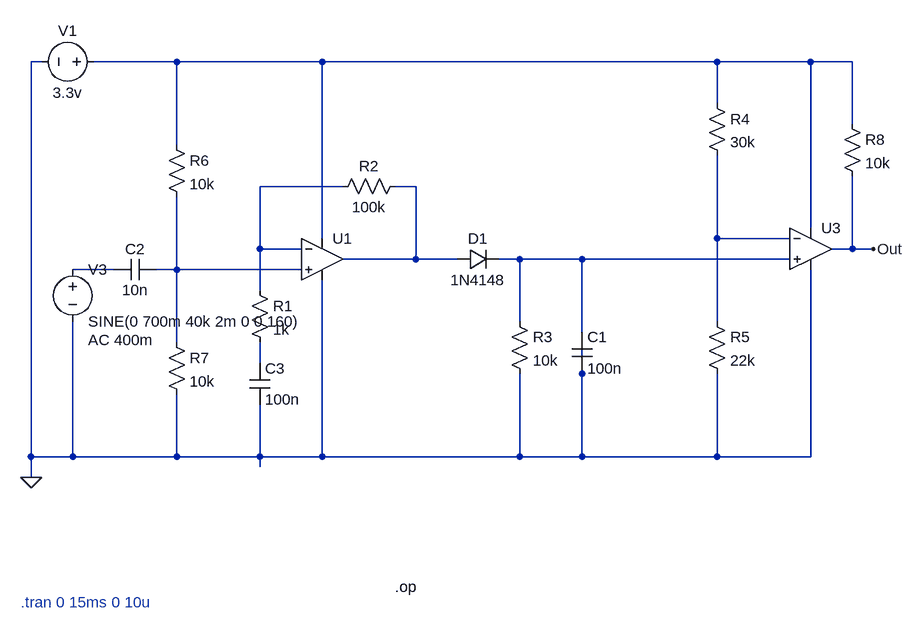
[diagram p0: schematic Ultrasound Sensor Schematic.asc]
Ultrasound Sensor Schematic.asc, the LTspice schematic file:
Version 4.1
SHEET 1 1020 724
WIRE -320 -272 -336 -272
WIRE -112 -272 -240 -272
WIRE 112 -272 -112 -272
WIRE 720 -272 112 -272
WIRE 864 -272 720 -272
WIRE 928 -272 864 -272
WIRE 720 -208 720 -272
WIRE 928 -176 928 -272
WIRE -112 -144 -112 -272
WIRE 144 -80 16 -80
WIRE 256 -80 224 -80
WIRE 864 -16 864 -272
WIRE 112 0 112 -272
WIRE 720 0 720 -128
WIRE 832 0 720 0
WIRE 16 16 16 -80
WIRE 80 16 16 16
WIRE 928 16 928 -96
WIRE 928 16 896 16
WIRE 960 16 928 16
WIRE 256 32 256 -80
WIRE 256 32 144 32
WIRE 320 32 256 32
WIRE 416 32 384 32
WIRE 512 32 416 32
WIRE 832 32 512 32
WIRE -208 48 -272 48
WIRE -112 48 -112 -64
WIRE -112 48 -144 48
WIRE 80 48 -112 48
WIRE 16 80 16 16
WIRE 416 128 416 32
WIRE 720 128 720 0
WIRE 512 144 512 32
WIRE -112 160 -112 48
WIRE 16 192 16 160
WIRE 512 208 512 160
WIRE -336 336 -336 -272
WIRE -272 336 -272 128
WIRE -272 336 -336 336
WIRE -112 336 -112 240
WIRE -112 336 -272 336
WIRE 16 336 16 256
WIRE 16 336 -112 336
WIRE 112 336 112 64
WIRE 112 336 16 336
WIRE 416 336 416 208
WIRE 416 336 112 336
WIRE 512 336 512 208
WIRE 512 336 416 336
WIRE 720 336 720 208
WIRE 720 336 512 336
WIRE 864 336 864 48
WIRE 864 336 720 336
WIRE 16 352 16 336
WIRE -336 368 -336 336
FLAG 960 16 Out
FLAG -336 368 0
SYMBOL voltage -272 32 R0
WINDOW 123 24 124 Left 2
WINDOW 39 0 0 Left 0
SYMATTR InstName V3
SYMATTR Value SINE(0 700m 40k 2m 0 0 160)
SYMATTR Value2 AC 400m
SYMBOL res 0 64 R0
SYMATTR InstName R1
SYMATTR Value 1k
SYMBOL res 240 -96 R90
WINDOW 0 0 56 VBottom 2
WINDOW 3 32 56 VTop 2
SYMATTR InstName R2
SYMATTR Value 100k
SYMBOL voltage -224 -272 R90
WINDOW 0 -32 56 VBottom 2
WINDOW 3 32 56 VTop 2
WINDOW 123 0 0 Left 0
WINDOW 39 0 0 Left 0
SYMATTR InstName V1
SYMATTR Value 3.3v
SYMBOL diode 320 48 R270
WINDOW 0 32 32 VTop 2
WINDOW 3 0 32 VBottom 2
SYMATTR InstName D1
SYMATTR Value 1N4148
SYMBOL res 400 112 R0
SYMATTR InstName R3
SYMATTR Value 10k
SYMBOL cap 496 144 R0
SYMATTR InstName C1
SYMATTR Value 100n
SYMBOL res 704 -224 R0
SYMATTR InstName R4
SYMATTR Value 30k
SYMBOL res 704 112 R0
SYMATTR InstName R5
SYMATTR Value 22k
SYMBOL cap -144 32 R90
WINDOW 0 0 32 VBottom 2
WINDOW 3 32 32 VTop 2
SYMATTR InstName C2
SYMATTR Value 10n
SYMBOL res -128 -160 R0
SYMATTR InstName R6
SYMATTR Value 10k
SYMBOL res -128 144 R0
SYMATTR InstName R7
SYMATTR Value 10k
SYMBOL res 912 -192 R0
SYMATTR InstName R8
SYMATTR Value 10k
SYMBOL OpAmps\\UniversalOpAmp2 112 32 R0
SYMATTR InstName U1
SYMBOL OpAmps\\UniversalOpAmp2 864 16 R0
SYMATTR InstName U3
SYMBOL cap 0 192 R0
SYMATTR InstName C3
SYMATTR Value 100n
TEXT 224 536 Left 2 !.op
TEXT -352 560 Left 2 ;.tran 0 15ms 0 10u

The netlist it stands for:
* Ultrasound Sensor Schematic.asc
V3 N006 0 SINE(0 700m 40k 2m 0 0 160) AC 400m
R1 N002 N008 1k
R2 N003 N002 100k
V1 N001 0 3.3v
D1 N003 N005 1N4148
R3 N005 0 10k
C1 N005 0 100n
R4 N001 N004 30k
R5 N004 0 22k
C2 N007 N006 10n
R6 N001 N007 10k
R7 N007 0 10k
R8 N001 Out 10k
X§U1 N007 N002 N001 0 N003 level2 Avol=1Meg GBW=10Meg Slew=10Meg Ilimit=25m Rail=0 Vos=0 En=0 Enk=0 In=0 Ink=0 Rin=500Meg  ; pins In+ In- V+ V- OUT
X§U3 N005 N004 N001 0 Out level2 Avol=1Meg GBW=10Meg Slew=10Meg Ilimit=25m Rail=0 Vos=0 En=0 Enk=0 In=0 Ink=0 Rin=500Meg  ; pins In+ In- V+ V- OUT
C3 N008 0 100n
.model D D
.lib standard.dio
.op
* .tran 0 15ms 0 10u
.lib UniversalOpAmp2.lib
.backanno
.end